# Altium schematic sheet UnitD.SchDoc
size 297 x 209 mm
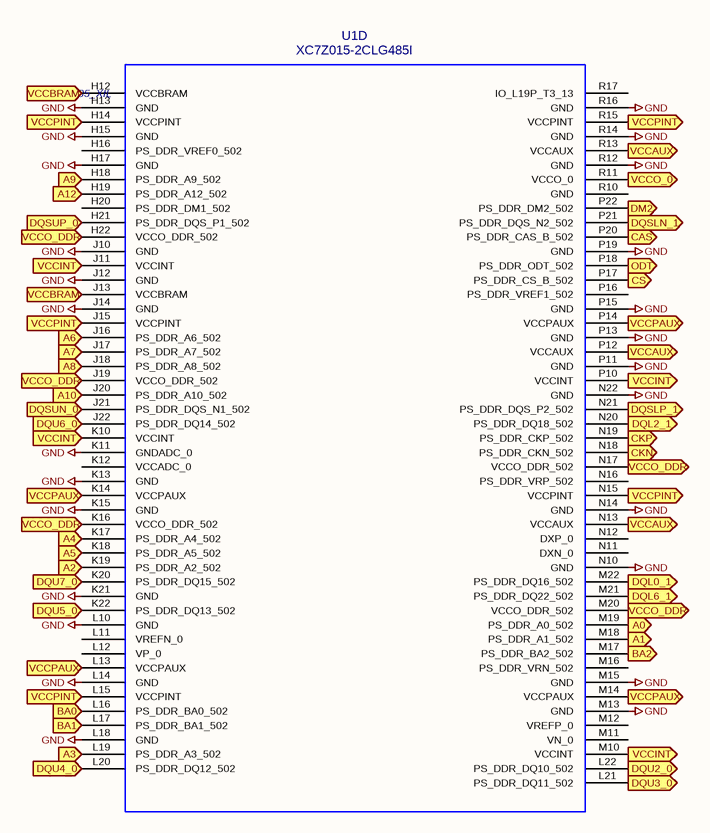
[diagram p0: UnitD.SchDoc]

## Parts
U1  XC7Z015-2CLG485I  [CLG485_XIL]  (part D of 5)

## Ports
A0 (in), A1 (in), A2 (in), A3 (in), A4 (in), A5 (in), A6 (in), A7 (in), A8 (in), A9 (in), A10 (in), A12 (in), BA0 (in), BA1 (in), BA2 (in), CAS (in), CKN (in), CKP (in), CS (in), DM2 (in), DQL0_1 (in), DQL2_1 (in), DQL6_1 (in), DQSLN_1 (in), DQSLP_1 (in), DQSUN_0 (in), DQSUP_0 (in), DQU2_0 (in), DQU3_0 (in), DQU4_0 (in), DQU5_0 (in), DQU6_0 (in), DQU7_0 (in), ODT (in), VCCAUX (in), VCCBRAM (in), VCCINT (in), VCCO_0 (in), VCCO_DDR (in), VCCPAUX (in), VCCPINT (in)

## Nets
GND: U1.H13(GND) U1.H15(GND) U1.H17(GND) U1.J10(GND) U1.J12(GND) U1.J14(GND) U1.K11(GNDADC_0) U1.K13(GND) U1.K15(GND) U1.K21(GND) U1.L10(GND) U1.L14(GND) U1.L18(GND) U1.M13(GND) U1.M15(GND) U1.N10(GND) U1.N14(GND) U1.N22(GND) U1.P11(GND) U1.P13(GND) U1.P15(GND) U1.P19(GND) U1.R12(GND) U1.R14(GND) U1.R16(GND)
A0: U1.M19(PS_DDR_A0_502) ; port A0
A1: U1.M18(PS_DDR_A1_502) ; port A1
A2: U1.K19(PS_DDR_A2_502) ; port A2
A3: U1.L19(PS_DDR_A3_502) ; port A3
A4: U1.K17(PS_DDR_A4_502) ; port A4
A5: U1.K18(PS_DDR_A5_502) ; port A5
A6: U1.J16(PS_DDR_A6_502) ; port A6
A7: U1.J17(PS_DDR_A7_502) ; port A7
A8: U1.J18(PS_DDR_A8_502) ; port A8
A9: U1.H18(PS_DDR_A9_502) ; port A9
A10: U1.J20(PS_DDR_A10_502) ; port A10
A12: U1.H19(PS_DDR_A12_502) ; port A12
BA0: U1.L16(PS_DDR_BA0_502) ; port BA0
BA1: U1.L17(PS_DDR_BA1_502) ; port BA1
BA2: U1.M17(PS_DDR_BA2_502) ; port BA2
CAS: U1.P20(PS_DDR_CAS_B_502) ; port CAS
CKN: U1.N18(PS_DDR_CKN_502) ; port CKN
CKP: U1.N19(PS_DDR_CKP_502) ; port CKP
CS: U1.P17(PS_DDR_CS_B_502) ; port CS
DM2: U1.P22(PS_DDR_DM2_502) ; port DM2
DQL0_1: U1.M22(PS_DDR_DQ16_502) ; port DQL0_1
DQL2_1: U1.N20(PS_DDR_DQ18_502) ; port DQL2_1
DQL6_1: U1.M21(PS_DDR_DQ22_502) ; port DQL6_1
DQSLN_1: U1.P21(PS_DDR_DQS_N2_502) ; port DQSLN_1
DQSLP_1: U1.N21(PS_DDR_DQS_P2_502) ; port DQSLP_1
DQSUN_0: U1.J21(PS_DDR_DQS_N1_502) ; port DQSUN_0
DQSUP_0: U1.H21(PS_DDR_DQS_P1_502) ; port DQSUP_0
DQU2_0: U1.L22(PS_DDR_DQ10_502) ; port DQU2_0
DQU3_0: U1.L21(PS_DDR_DQ11_502) ; port DQU3_0
DQU4_0: U1.L20(PS_DDR_DQ12_502) ; port DQU4_0
DQU5_0: U1.K22(PS_DDR_DQ13_502) ; port DQU5_0
DQU6_0: U1.J22(PS_DDR_DQ14_502) ; port DQU6_0
DQU7_0: U1.K20(PS_DDR_DQ15_502) ; port DQU7_0
ODT: U1.P18(PS_DDR_ODT_502) ; port ODT
VCCAUX: U1.N13(VCCAUX) U1.P12(VCCAUX) U1.R13(VCCAUX) ; port VCCAUX
VCCBRAM: U1.H12(VCCBRAM) U1.J13(VCCBRAM) ; port VCCBRAM
VCCINT: U1.J11(VCCINT) U1.K10(VCCINT) U1.M10(VCCINT) U1.P10(VCCINT) ; port VCCINT
VCCO_0: U1.R11(VCCO_0) ; port VCCO_0
VCCO_DDR: U1.H22(VCCO_DDR_502) U1.J19(VCCO_DDR_502) U1.K16(VCCO_DDR_502) U1.M20(VCCO_DDR_502) U1.N17(VCCO_DDR_502) ; port VCCO_DDR
VCCPAUX: U1.K14(VCCPAUX) U1.L13(VCCPAUX) U1.M14(VCCPAUX) U1.P14(VCCPAUX) ; port VCCPAUX
VCCPINT: U1.H14(VCCPINT) U1.J15(VCCPINT) U1.L15(VCCPINT) U1.N15(VCCPINT) U1.R15(VCCPINT) ; port VCCPINT

Not connected (* = marked no-connect by the designer): U1 H16(PS_DDR_VREF0_502) H20(PS_DDR_DM1_502) K12(VCCADC_0) L11(VREFN_0) L12(VP_0) M11(VN_0) M12(VREFP_0) M16(PS_DDR_VRN_502) N11(DXN_0) N12(DXP_0) N16(PS_DDR_VRP_502) P16(PS_DDR_VREF1_502) R10(GND) R17(IO_L19P_T3_13)

## Notes on the sheet
- 1
- 2
- 3
- 4
- 5
- 6
- A
- B
- C
- D
- Title:
- File: UnitD.kicad_sch
- Sheet: /
- KiCad E.D.A.  kicad (5.1.4)-1
- Size: A4
- Date:
- Rev:
- Id: 1/1

## Library data of the parts
U1 = XC7Z015-2CLG485I: Value: XC7Z015-2CLG485I